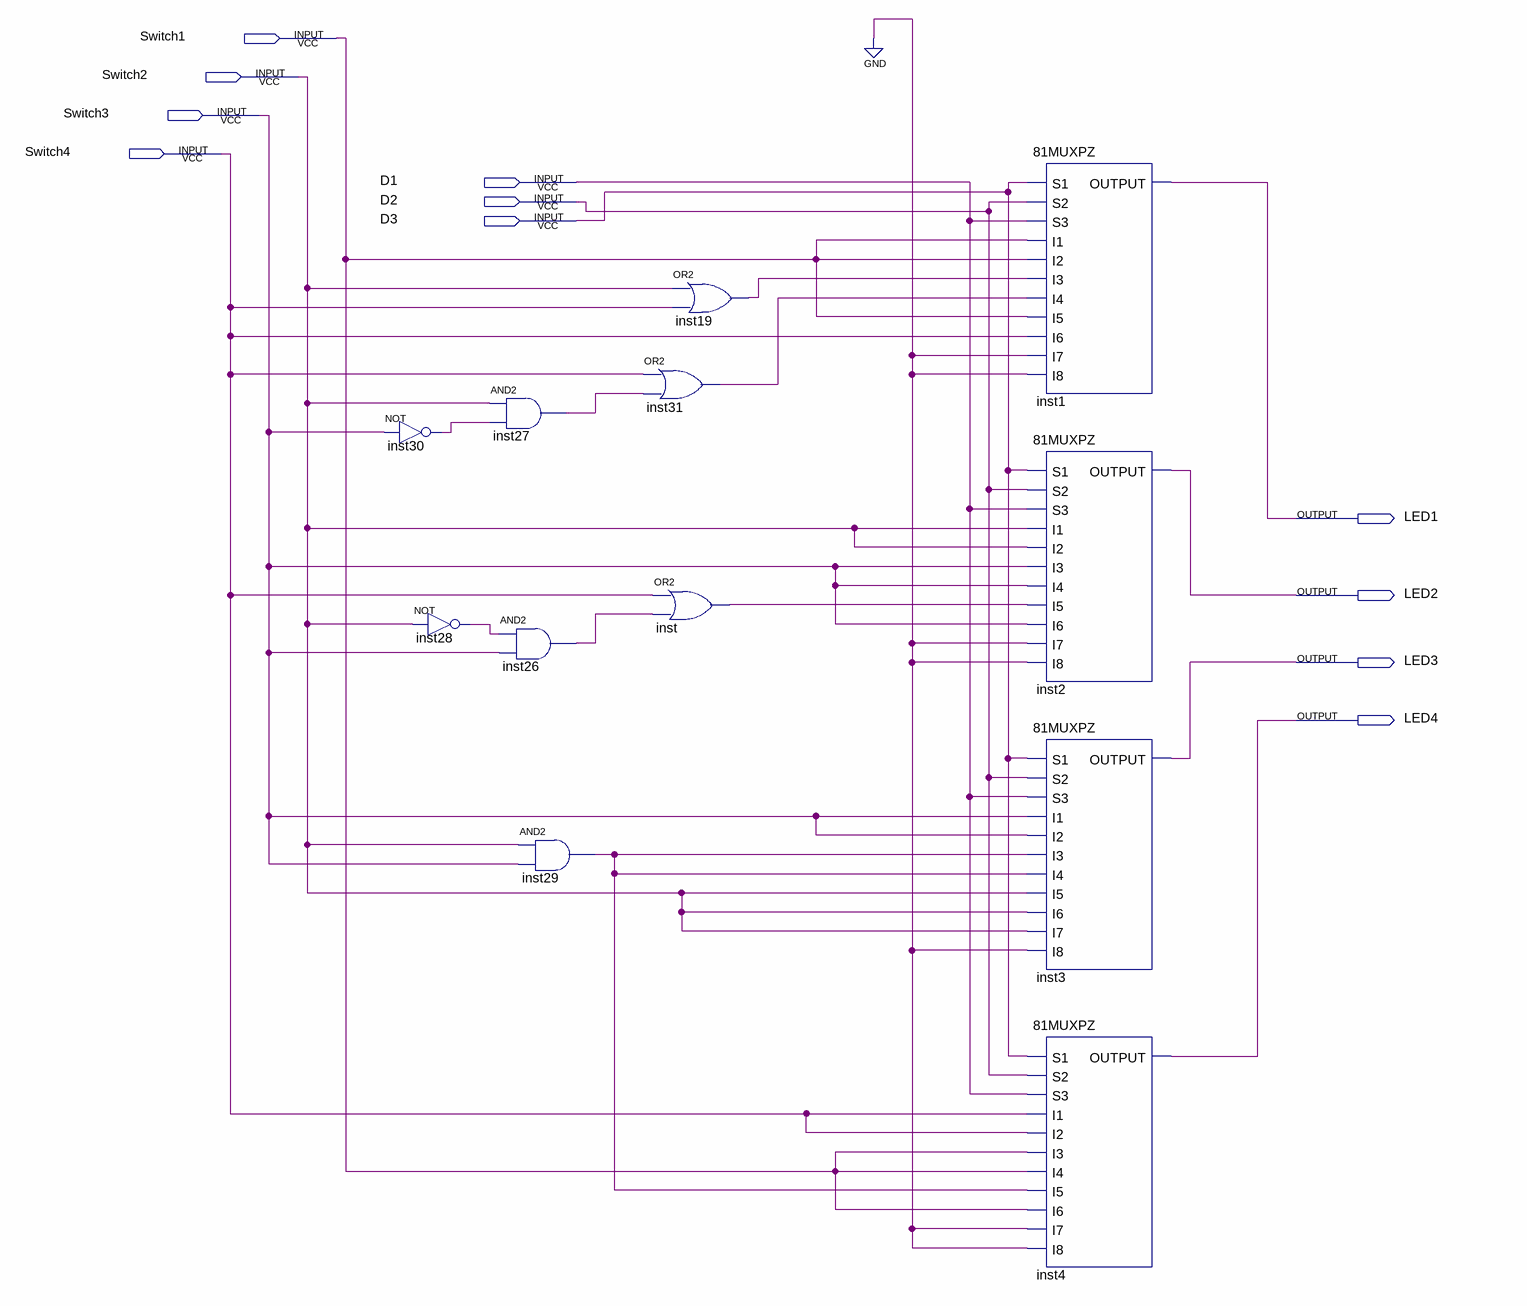
[diagram p0: schematic sheet]
// Quartus schematic LEDOutput.bdf as structural Verilog: 12 symbols, 11 pins
module LEDOutput (
  input  Switch1,
  input  Switch2,
  input  Switch3,
  input  Switch4,
  input  D1,
  input  D2,
  input  D3,
  output LED1,
  output LED2,
  output LED3,
  output LED4
);

  wire inst19_out, inst26_out, inst27_out, inst28_out, inst29_out, inst30_out, inst31_out, inst_out;

  not inst30 (inst30_out, Switch3);
  not inst28 (inst28_out, Switch2);
  and inst27 (inst27_out, Switch2, inst30_out);
  and inst26 (inst26_out, inst28_out, Switch3);
  and inst29 (inst29_out, Switch2, Switch3);
  or inst19 (inst19_out, Switch2, Switch4);
  or inst31 (inst31_out, Switch4, inst27_out);
  or inst (inst_out, Switch4, inst26_out);
  \81MUXPZ  inst1 (
    .S1(D3), .S2(D2), .S3(D1), .I1(Switch1), .I2(Switch1), .I3(inst19_out), .I4(inst31_out), .I5(Switch1),
    .I6(Switch4), .I7(1'b0), .I8(1'b0), .OUTPUT(LED1));
  \81MUXPZ  inst2 (
    .S1(D3), .S2(D2), .S3(D1), .I1(Switch2), .I2(Switch2), .I3(Switch3), .I4(Switch3), .I5(inst_out),
    .I6(Switch3), .I7(1'b0), .I8(1'b0), .OUTPUT(LED2));
  \81MUXPZ  inst3 (
    .S1(D3), .S2(D2), .S3(D1), .I1(Switch3), .I2(Switch3), .I3(inst29_out), .I4(inst29_out), .I5(Switch2),
    .I6(Switch2), .I7(Switch2), .I8(1'b0), .OUTPUT(LED3));
  \81MUXPZ  inst4 (
    .S1(D3), .S2(D2), .S3(D1), .I1(Switch4), .I2(Switch4), .I3(Switch1), .I4(Switch1), .I5(inst29_out),
    .I6(Switch1), .I7(1'b0), .I8(1'b0), .OUTPUT(LED4));
endmodule
